# EAGLE design rw-linear-17mm-mk-1.2.2 (EAGLE 7.5.0)
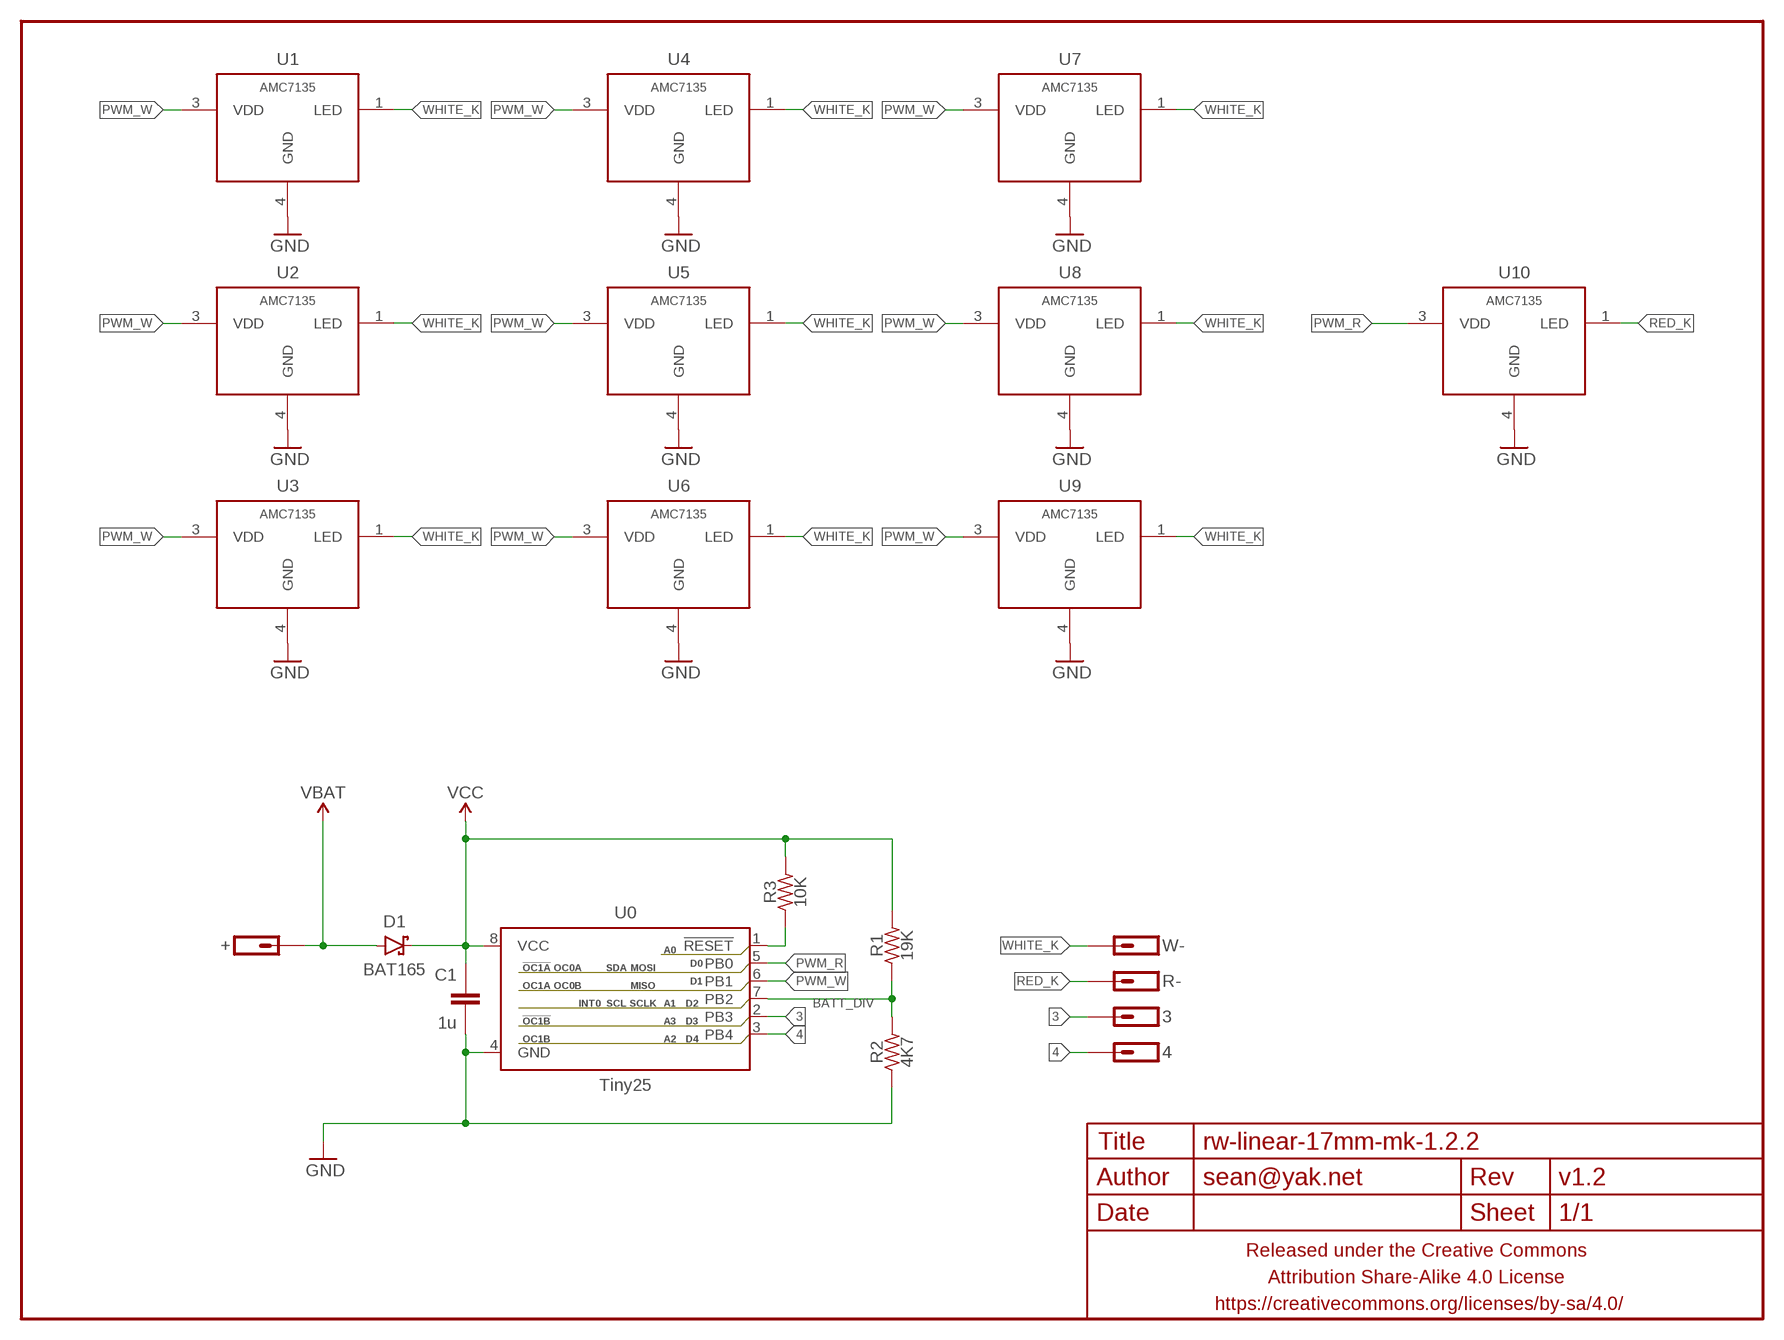
[diagram p0: schematic, sheet 1]

## Parts
3  M01SMD-1MM-DIA-NS  [1X01-SMD-1MM-DIA-NS]
4  M01SMD-1MM-DIA-NS  [1X01-SMD-1MM-DIA-NS]
+  M01PTH-1.2MM-NS  [1X01-1.2MM-NS]
C1  1u  CAPACITOR-CERAMICC0402  [C0402]
D1  BAT165  DIODE-SCHOTTKYSOD323  [SOD323-SCHOTTKY]
FRAME1  FRAME-LETTERNO_PACKAGE  [DUMMY]
R1  19K  RESISTORR0402  [R0402]
R2  4K7  RESISTORR0402  [R0402]
R3  10K  RESISTORR0402  [R0402]
R-  M01SMD-1.25MM-DIA  [1X01-SMD-1.25MM-DIA-NS]
U0  Tiny25  ATTINY13SOIC-NARROWPADS  [SO08-NARROWER]
U1  AMC7135  AMC7135SOT-89-NOTHERM-ROUNDED-LESS  [SOT89-NOTHERM-ROUNDED-LESS]
U2  AMC7135  AMC7135SOT-89-NOTHERM-ROUNDED-LESS  [SOT89-NOTHERM-ROUNDED-LESS]
U3  AMC7135  AMC7135SOT-89-NOTHERM-ROUNDED-LESS  [SOT89-NOTHERM-ROUNDED-LESS]
U4  AMC7135  AMC7135SOT-89-NOTHERM-ROUNDED-LESS  [SOT89-NOTHERM-ROUNDED-LESS]
U5  AMC7135  AMC7135SOT-89-NOTHERM-ROUNDED-LESS  [SOT89-NOTHERM-ROUNDED-LESS]
U6  AMC7135  AMC7135SOT-89-NOTHERM-ROUNDED-LESS  [SOT89-NOTHERM-ROUNDED-LESS]
U7  AMC7135  AMC7135SOT-89-NOTHERM-ROUNDED-LESS  [SOT89-NOTHERM-ROUNDED-LESS]
U8  AMC7135  AMC7135SOT-89-NOTHERM-ROUNDED-LESS  [SOT89-NOTHERM-ROUNDED-LESS]
U9  AMC7135  AMC7135SOT-89-NOTHERM-ROUNDED-LESS  [SOT89-NOTHERM-ROUNDED-LESS]
U10  AMC7135  AMC7135SOT-89-NOTHERM-ROUNDED-LESS  [SOT89-NOTHERM-ROUNDED-LESS]
W-  M01SMD-1.5MM-DIA-NS  [1X01-SMD-1.5MM-DIA-NS]

## Nets
3: 3.P$1 U0.2(PB3)
4: 4.P$1 U0.3(PB4)
BATT_DIV: R1.1 R2.2 U0.7(PB2)
GND: C1.2 R2.1 U0.4(GND) U1.4(GND) U2.4(GND) U3.4(GND) U4.4(GND) U5.4(GND) U6.4(GND) U7.4(GND) U8.4(GND) U9.4(GND) U10.4(GND)
N$1: R3.1 U0.1(!RESET)
PWM_R: U0.5(PB0) U10.3(VDD)
PWM_W: U0.6(PB1) U1.3(VDD) U2.3(VDD) U3.3(VDD) U4.3(VDD) U5.3(VDD) U6.3(VDD) U7.3(VDD) U8.3(VDD) U9.3(VDD)
RED_K: R-.P$1 U10.1(LED)
VBAT: +.P$1 D1.A
VCC: C1.1 D1.C R1.2 R3.2 U0.8(VCC)
WHITE_K: U1.1(LED) U2.1(LED) U3.1(LED) U4.1(LED) U5.1(LED) U6.1(LED) U7.1(LED) U8.1(LED) U9.1(LED) W-.P$1

## Library data of the parts
3 4 + R- W- = a_parts:M01: Header 1 Standard 1-pin 0.1" header. Use with straight break away headers (SKU : PRT-00116), right angle break away headers (PRT-00553), swiss pins (PRT-00743), machine pins (PRT-00117), and female headers (PRT-00115).
C1 = a_parts:CAPACITOR-CERAMIC: CAPACITOR, European symbol
D1 = a_parts:DIODE-SCHOTTKY: Schottky diodes in SFE's production catalog BAT20J 1A 23V 0.62Vf RB751 120mA 40V 0.37Vf PMEG4005EJ 0.5A 40V 0.42Vf MBRA140 1A 40V 0.5Vf B340A 3A 40V SMA
FRAME1 = a_parts:FRAME-LETTER: Schematic Frame Standard 8.5x11 US Letter frame; DESIGNER: sean@yak.net; VERSION: v1.2
R1-R3 = a_parts:RESISTOR: RESISTOR, American symbol
U0 = a_parts:ATTINY13: Atmel 8-pin 1kB flash uC
U1-U10 = a_parts:AMC7135

## Board
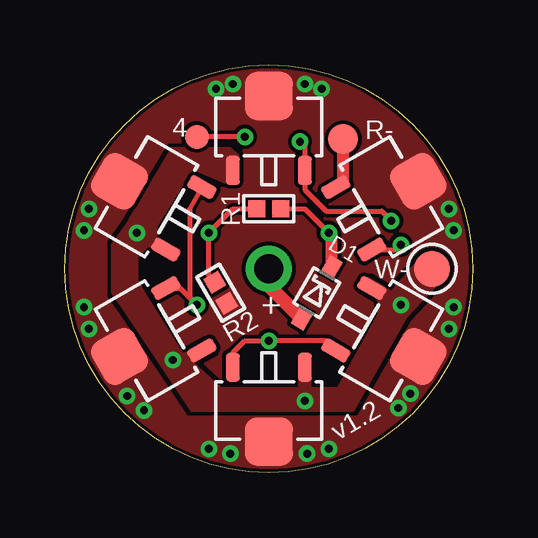
[diagram p1: board, top side]
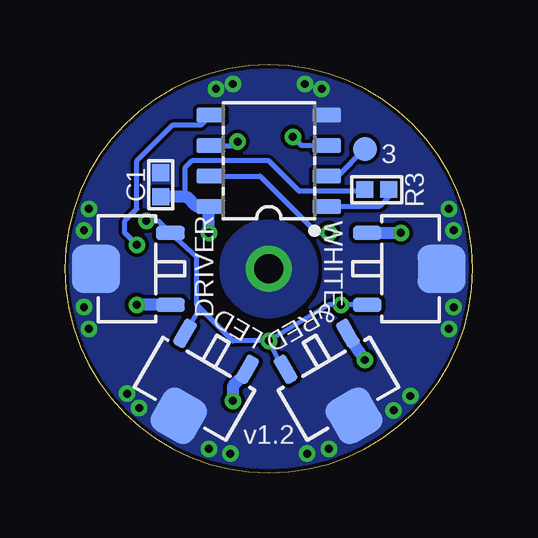
[diagram p2: board, bottom side, seen from below]

Size 17 x 17 mm. Coordinates in mm from the lower left corner, seen from the top.
Outline: 0,8.5 arc-180 17,8.5 arc-180 0,8.5
Copper layers (1*16): Top 0.0356mm / dielectric 1.5011mm / Bottom 0.0356mm
Design rules "LaenPCBOrder2": minimum track width 6mil, minimum drill 13mil, track to track 6mil, track to pad 6mil, pad to pad 6mil, via to via 6mil, smd to smd 6mil, copper to edge 6mil, drill to drill 6mil, minimum pad ring 7mil, minimum via ring 7mil, stop-mask expansion 3mil, vias tented up to drill 20mil, thermal gap 10mil

### Footprints (pad centres in the part's own frame; a part is rotated, then mirrored left to right if it is on the bottom)
1X01-SMD-1MM-DIA-NS = smd 1 x 1: P$1 0,0
1X01-1.2MM-NS = drill 1.2 pad 1.93: P$1 0,0
C0402 = smd 0.7 x 0.7: 1 -0.5,0; 2 0.5,0
SOD323-SCHOTTKY = smd 0.8 x 0.6: A -1.25,0; C 1.25,0
R0402 = smd 0.7 x 0.7: 1 -0.5,0; 2 0.5,0
1X01-SMD-1.25MM-DIA-NS = smd 1.25 x 1.25: P$1 0,0
SO08-NARROWER = smd 0.6 x 1.2: 1 -1.905,-2.416; 2 -0.635,-2.416; 3 0.635,-2.416; 4 1.905,-2.416; 5 1.905,2.416; 6 0.635,2.416; 7 -0.635,2.416; 8 -1.905,2.416
SOT89-NOTHERM-ROUNDED-LESS = smd 0.58 x 1.2: 1 -1.5,-1.8; 3 1.5,-1.8 | smd 2 x 2: 4 0,1.3
1X01-SMD-1.5MM-DIA-NS = smd 1.5 x 1.5: P$1 0,0

### Placement (x,y rotation side)
3  4.5,13.5 0 bottom
4  5.5,14 0 top
+  8.5,8.5 90 top
C1  13,12 90 bottom
D1  10.5,7.5 60 top
FRAME1  0,0 0 top
R1  8.5,11 0 top
R2  6.5,7.5 120 top
R3  4,11.8 180 bottom
R-  11.6,13.9 0 top
U0  8.5,13 90 bottom
U1  8.5,14.4 0 top
U2  14.4,8.5 90 bottom
U3  13.6,5.5 240 top
U4  8.5,2.6 180 top
U5  3.4,5.5 120 top
U6  3.4,11.5 60 top
U7  11.6,3.5 150 bottom
U8  5.6,3.5 210 bottom
U9  2.6,8.5 270 bottom
U10  13.6,11.5 300 top
W-  15.3,8.5 270 top

### Tracks (layer width: path | path; a pad name or v marks a point on that pad's centre or on a via)
3
  Bottom 0.2: U0.2 5.63,12.37 3.P$1
4  (via drill 0.33)
  Top 0.2: v7.5,14 4.P$1
  Bottom 0.2: U0.3 7.13,13.63 v7.5,14
BATT_DIV  (via drill 0.33)
  Top 0.2: R2.2 6,8.18 v6,10 7,11 R1.1
  Bottom 0.2: U0.7 8.87,12.37 6.5,10 v6,10
GND  (via drill 0.33)
  other vias: 0.8,6.9 2.6,3.2 3.3,2.6 1,6 6,1 6.9,0.8 10.1,0.8 11,1 13.9,2.7 14.4,3.3 16,6 16.2,6.9 16.2,10.1 16,11 0.8,10.1 1,11 7,16.2 10,16.2 6.3,16 10.7,16
  pour Top (isolate 0.152, rank 6, no thermals): 0,8.5 arc90 8.5,0 arc90 17,8.5 arc90 8.5,17 arc90
  pour Bottom (isolate 0.152, rank 6, no thermals): 17,8.5 arc-90 8.5,0 arc-90 0,8.5 arc-90 8.5,17 arc-90
N$1
  Bottom 0.2: R3.1 3.5,11.5 3.9,11.1 U0.1
PWM_R  (via drill 0.33)
  Top 0.2: U10.3 13.8,9.3 v14,9.5
  Bottom 0.2: v14,9.5 14.5,10 14.5,10.5 14,11 14,13 12.5,14.5 11.32,14.5 U0.5
PWM_W  (via drill 0.33)
  Top 0.2: v9.8,13.8 10,13.6 U1.3 10,11.8 10.9,10.9 13.2,10.9 v13.6,10.5 | U5.3 4.8,7.7 v5.5,7 5.2,7.3 5.2,11 U6.3 | U4.3 7,5 7.5,5.5 v8.5,5.5 10.89,5.5 U3.3
  Bottom 0.2: U0.6 9.96,13.63 v9.8,13.8 | U8.3 8,4.51 v8.5,5.5 | v8.5,5.5 10,5.5 11.35,6.85 | 11.35,6.85 11.5,7 11.5,9 U2.3 13.1,10.5 v13.6,10.5 | U7.3 11.35,6.85 | U9.3 v5.5,7 6,7 v8.5,5.5
RED_K
  Top 0.5: U10.1 11.6,12.11 R-.P$1
VBAT
  Top 0.575: +.P$1 8.5,7.79 D1.A
  pour Bottom (isolate 0.152, no thermals): 6.5,8.5 arc-180 10.5,8.5 arc-180
VCC  (via drill 0.33)
  Top 0.2: R1.2 10,11 v11,10
  Top 0.5: D1.C 11.12,9.88 v11,10
  Bottom 0.2: R3.2 4.57,11.73 7.23,11.73 8.5,13 11.7,13 12,12.7 12,11.5
  Bottom 0.5: C1.1 12,11.5 11.9,11.5 11.49,11.1 U0.8 11,11.01 v11,10
WHITE_K  (via drill 0.33)
  Bottom 0.5: U8.1 5.2,5.7 v4.5,4.7 | U7.1 9.4,4.2 10,3.6 v10,3 | U2.1 v14,7 | U9.1 v3,10
  pour Top (isolate 0.152, rank 2, no thermals): 12.6,8.1 13.6,7.5 14.9,9 15.6,9 15.9,8.3 14.2,6.5 12,2.6 5.3,2.6 2.5,6.8 2,7.5 2,9.5 2.7,10.5 4.5,13.5 6.9,13.5 7.2,13.2 7.2,12.2 6.7,12.1 5.3,12.7 3.8,10.3 3.8,9.7 4.7,9.2 4.5,8.9 3.5,9.5 3,9 3,8 3.4,7.3 4.9,4.9 5.1,5 6,5.5 6.2,5.1 5.3,4.6 6.5,3.5 9.8,3.5 9.8,4.6 10.2,4.6 10.2,3.5 11.4,3.5 13.1,6.6 13.1,7.3 12.4,7.7

### Text on the board
bPlace: WHITE | DRIVER | & | RED | LED